# Altium project ArduinoUno_project.PrjPcb
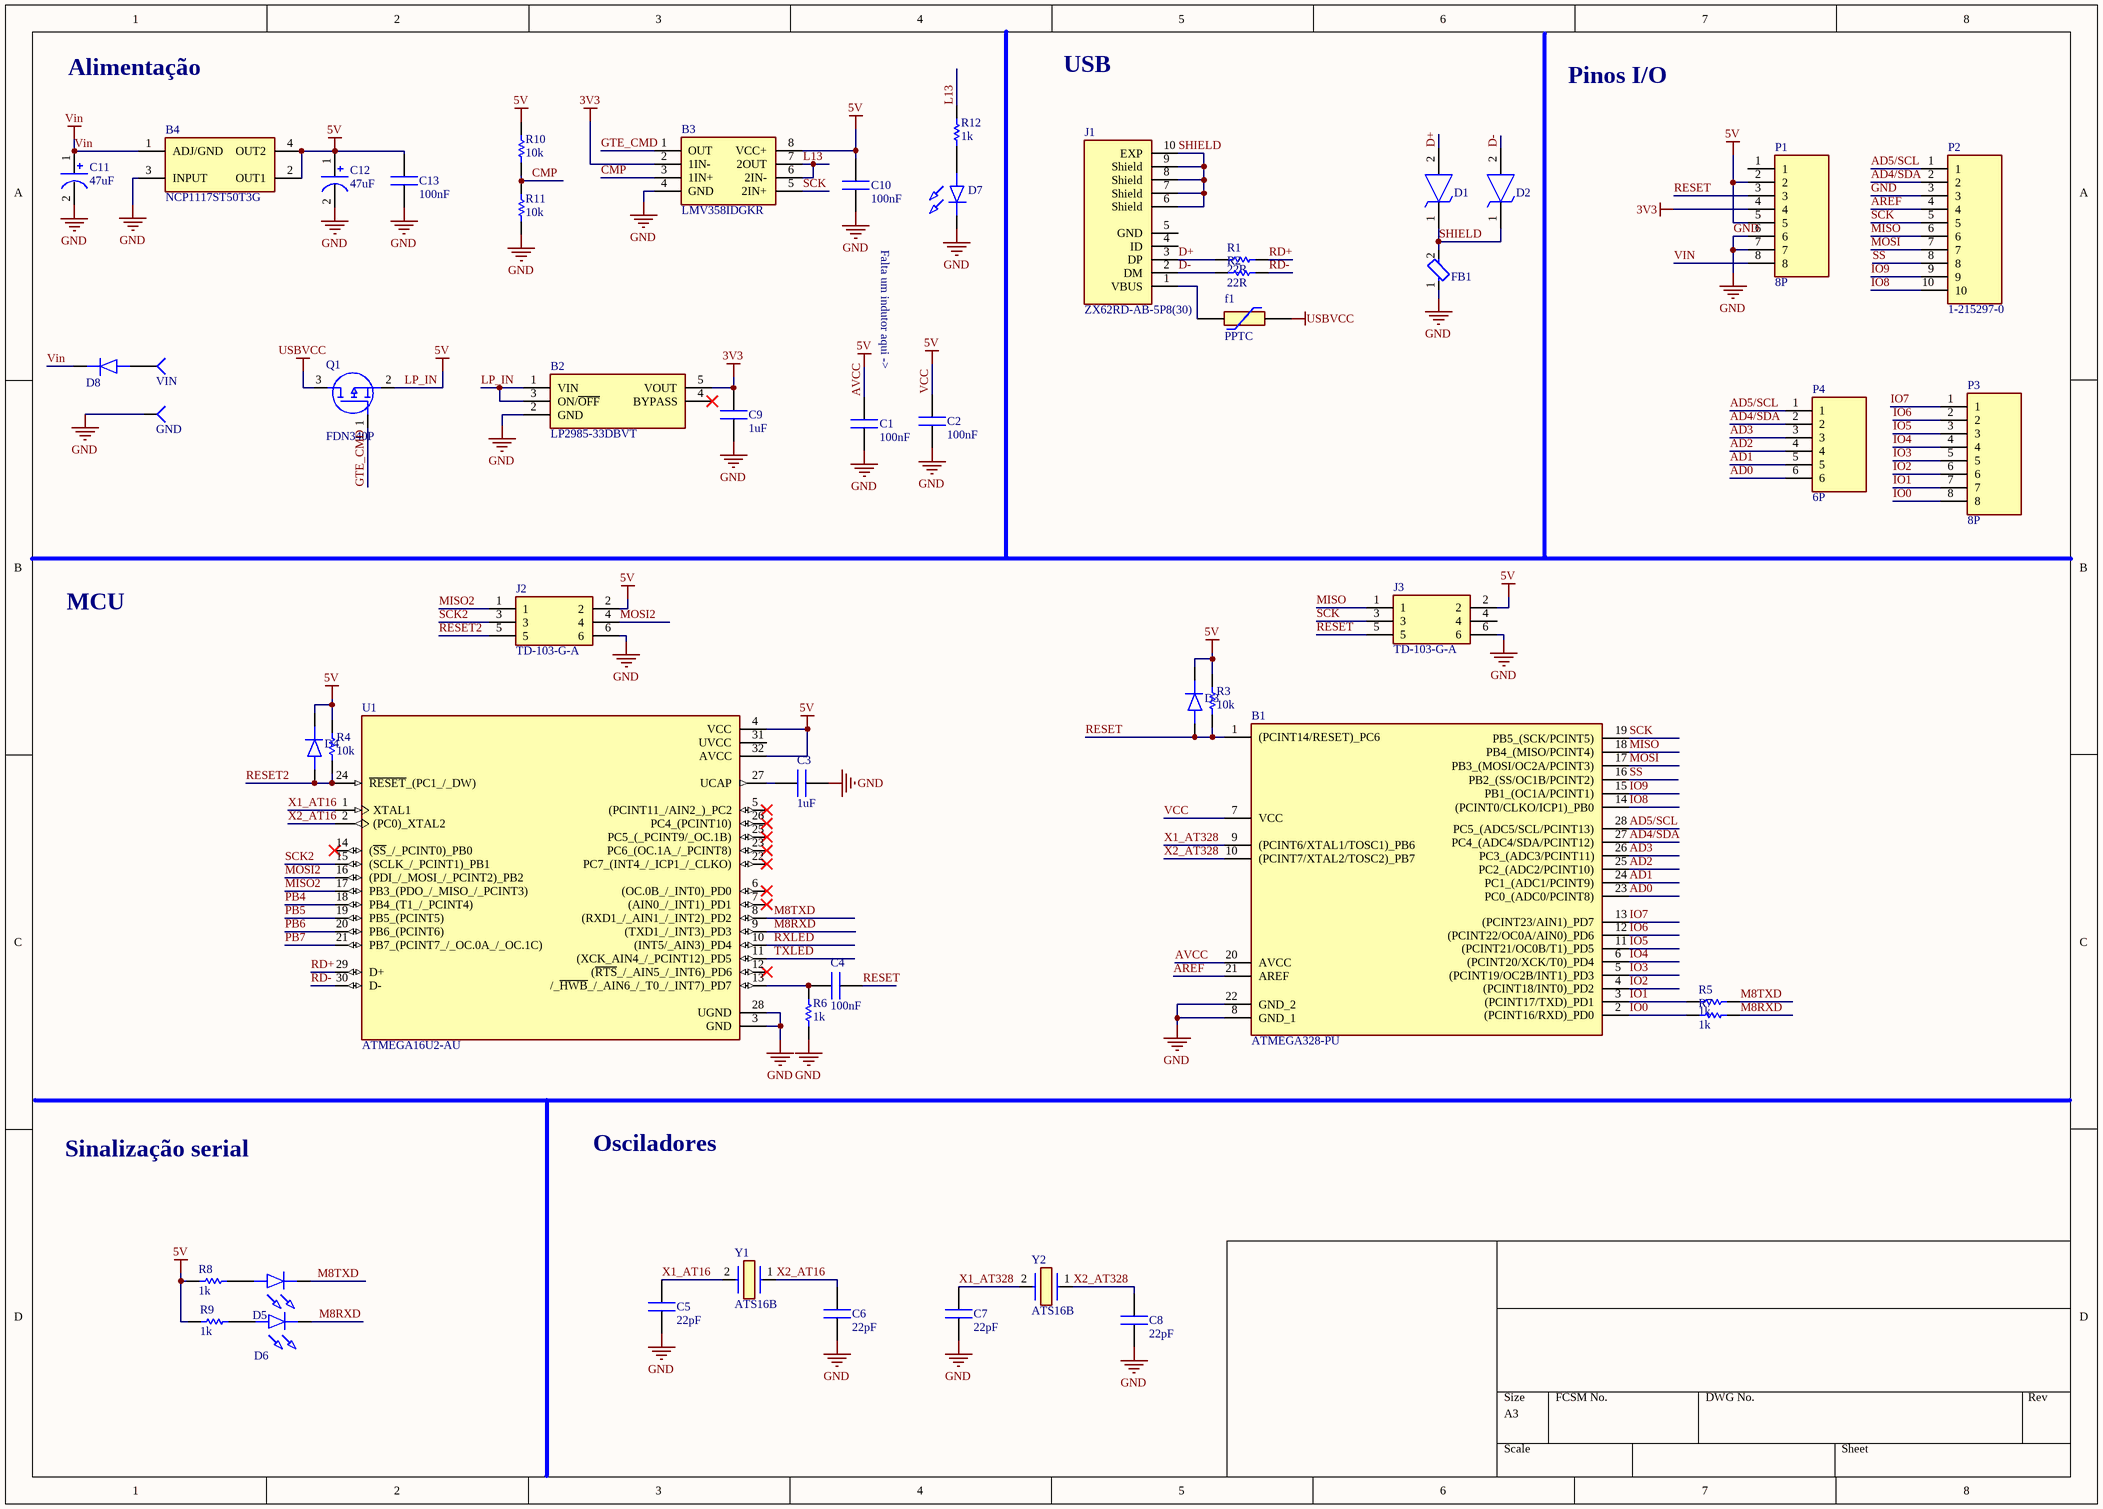
[diagram p0: ArduinoUno_project.SchDoc]
1 sheet, 52 parts. Net scope: global (net labels, ports and power ports of the same name join across sheets).
Board file: ArduinoUno_project.PcbDoc

## Sheet ArduinoUno_project.SchDoc
size A3; SheetNumber: 1; SheetTotal: 1

### Parts
B1  ATMEGA328-PU  [DIP1016W53P254L3468H457Q28N]
B2  LP2985-33DBVT  [SOT95P280X145-5N]
B3  LMV358IDGKR  [SOP65P490X110-8N]
B4  NCP1117ST50T3G  [SOT230P700X180-4N]
C1  100nF  [C0805]
C2  100nF  [C0805]
C3  1uF  [C0805]
C4  100nF  [C0805]
C5  22pF  [C0402]
C6  22pF  [C0402]
C7  22pF  [C0402]
C8  22pF  [C0402]
C9  1uF  [C0805]
C10  100nF  [C0805]
C11  47uF  [CAPAE660X565N]
C12  47uF  [CAPAE660X565N]
C13  100nF  [C0805]
D1  CDSOD323-T05S  [SOD2513X114N]  (value not drawn)
D2  CDSOD323-T05S  [SOD2513X114N]  (value not drawn)
D3  1N914  [DIOAD1068W53L380D172]  (value not drawn)
D4  1N914  [DIOAD1068W53L380D172]  (value not drawn)
D5  TLHG5420-ASZ  [TLHG5420ASZ]  (value not drawn)
D6  TLHG5420-ASZ  [TLHG5420ASZ]  (value not drawn)
D7  TLHG5420-ASZ  [TLHG5420ASZ]  (value not drawn)
D8  1N914  [DIOAD1068W53L380D172]  (value not drawn)
f1  PPTC  [MFRHS10000]
FB1  1 kOhms @ 100MHz  [BLM21]  (value not drawn)
GND  Function  [Pin - 1]  (value not drawn)  (no BOM)
J1  ZX62RD-AB-5P8(30)  [FP-ZX62RD-AB-5P8_30-MFG]
J2  TD-103-G-A  [SAMTEC_TD-103-G-A]
J3  TD-103-G-A  [SAMTEC_TD-103-G-A]
P1  8P  [RHDR8W76P0X254_1X8_2032X356X673P]
P2  1-215297-0  [TE_1-215297-0]
P3  8P  [RHDR8W76P0X254_1X8_2032X356X673P]
P4  6P  [TE_215299-6]
Q1  FDN340P  [SOT95P237X112-3N]
R1  22R  [R0805]
R2  22R  [R0805]
R3  10k  [RESAD1075W45L335D185]
R4  10k  [RESAD1075W45L335D185]
R5  1k  [RESAD1075W45L335D185]
R6  1k  [RESAD1075W45L335D185]
R7  1k  [RESAD1075W45L335D185]
R8  1k  [RESAD1075W45L335D185]
R9  1k  [RESAD1075W45L335D185]
R10  10k  [RC0603]
R11  10k  [RC0603]
R12  1k  [RESAD1075W45L335D185]
U1  ATMEGA16U2-AU  [QFP80P900X900X120-32N]
VIN  Function  [Pin - 1]  (value not drawn)  (no BOM)
Y1  ATS16B  [ATS16B]
Y2  ATS16B  [ATS16B]

### Nets
3V3: B2.5(VOUT) B3.2(1IN-) C9.2 P1.4
AVCC: B1.7(VCC) B1.20(AVCC) B2.1(VIN) B2.3(ON/~{OFF}) B3.8(VCC+) B4.2(OUT1) B4.4(OUT2) C1.2 C2.2 C10.2 C12.1 C13.1 D3.1(K) D4.1(K) J2.2 J3.2 P1.2 P1.5 Q1.2(S) R3.2 R4.2 R8.2 R9.2 R10.2 U1.4(VCC) U1.32(AVCC)  [also labelled 5V, LP_IN, VCC]
GND: B1.8(GND_1) B1.22(GND_2) B2.2(GND) B3.4(GND) B4.3(INPUT) C1.1 C2.1 C3.2 C5.1 C6.2 C7.1 C8.2 C9.1 C10.1 C11.2 C12.2 C13.2 D7.1(K) FB1.1 GND.1 J2.6 J3.6 P1.6 P1.7 P2.3 R6.1 R11.1 U1.3(GND) U1.28(UGND)
USBVCC: f1.2 Q1.3(D)
VIN: B4.1(ADJ/GND) C11.1 D8.1(K) P1.8
AD0: B1.23(PC0_(ADC0/PCINT8)) P4.6
AD1: B1.24(PC1_(ADC1/PCINT9)) P4.5
AD2: B1.25(PC2_(ADC2/PCINT10)) P4.4
AD3: B1.26(PC3_(ADC3/PCINT11)) P4.3
AD4/SDA: B1.27(PC4_(ADC4/SDA/PCINT12)) P2.2 P4.2
AD5/SCL: B1.28(PC5_(ADC5/SCL/PCINT13)) P2.1 P4.1
AREF: B1.21(AREF) P2.4
CMP: B3.3(1IN+) R10.1 R11.2
D+: D1.2(A) J1.3(DP) R1.1
D-: D2.2(A) J1.2(DM) R2.1
GTE_CMD: B3.1(OUT) Q1.1(G)
IO0: B1.2((PCINT16/RXD)_PD0) P3.8 R7.2
IO1: B1.3((PCINT17/TXD)_PD1) P3.7 R5.2
IO2: B1.4((PCINT18/INT0)_PD2) P3.6
IO3: B1.5((PCINT19/OC2B/INT1)_PD3) P3.5
IO4: B1.6((PCINT20/XCK/T0)_PD4) P3.4
IO5: B1.11((PCINT21/OC0B/T1)_PD5) P3.3
IO6: B1.12((PCINT22/OC0A/AIN0)_PD6) P3.2
IO7: B1.13((PCINT23/AIN1)_PD7) P3.1
IO8: B1.14((PCINT0/CLKO/ICP1)_PB0) P2.10
IO9: B1.15(PB1_(OC1A/PCINT1)) P2.9
L13: B3.6(2IN-) B3.7(2OUT) R12.2
M8RXD: D6.1(K) R7.1 U1.9((TXD1_/_INT3)_PD3)
M8TXD: D5.1(K) R5.1 U1.8((RXD1_/_AIN1_/_INT2)_PD2)
MISO: B1.18(PB4_(MISO/PCINT4)) J3.1 P2.6
MISO2: J2.1 U1.17(PB3_(PDO_/_MISO_/_PCINT3))
MOSI: B1.17(PB3_(MOSI/OC2A/PCINT3)) P2.7
MOSI2: J2.4 U1.16((PDI_/_MOSI_/_PCINT2)_PB2)
PB4: U1.18(PB4_(T1_/_PCINT4))
PB5: U1.19(PB5_(PCINT5))
PB6: U1.20(PB6_(PCINT6))
PB7: U1.21(PB7_(PCINT7_/_OC.0A_/_OC.1C))
RD+: R1.2 U1.29(D+)
RD-: R2.2 U1.30(D-)
RESET: B1.1((PCINT14/RESET)_PC6) C4.2 D3.2(A) J3.5 P1.3 R3.1
RESET2: D4.2(A) J2.5 R4.1 U1.24(~{RESET}_(PC1_/_DW))
RXLED: U1.10((INT5/_AIN3)_PD4)
SCK: B1.19(PB5_(SCK/PCINT5)) B3.5(2IN+) J3.3 P2.5
SCK2: J2.3 U1.15((SCLK_/_PCINT1)_PB1)
SHIELD: D1.1(K) D2.1(K) FB1.2 J1.6(Shield) J1.7(Shield) J1.8(Shield) J1.9(Shield) J1.10(EXP)
SS: B1.16(PB2_(SS/OC1B/PCINT2)) P2.8
TXLED: U1.11((XCK_AIN4_/_PCINT12)_PD5)
X1_AT16: C5.2 U1.1(XTAL1) Y1.2(CRYSTAL_2)
X1_AT328: B1.9((PCINT6/XTAL1/TOSC1)_PB6) C7.2 Y2.2(CRYSTAL_2)
X2_AT16: C6.1 U1.2((PC0)_XTAL2) Y1.1
X2_AT328: B1.10((PCINT7/XTAL2/TOSC2)_PB7) C8.1 Y2.1
NetC3_1: C3.1 U1.27(UCAP)
NetC4_1: C4.1 R6.2 U1.13(/_~{HWB}_/_AIN6_/_T0_/_INT7)_PD7)
NetD5_2: D5.2(A) R8.1
NetD6_2: D6.2(A) R9.1
NetD7_2: D7.2(A) R12.1
NetD8_2: D8.2(A) VIN.1
Netf1_1: f1.1 J1.1(VBUS)

Not connected (* = marked no-connect by the designer): B2 4(BYPASS)*; J1 4(ID) 5(GND); J3 4; P1 1; U1 5((PCINT11_/AIN2_)_PC2)* 6((OC.0B_/_INT0)_PD0)* 7((AIN0_/_INT1)_PD1)* 12((~{RTS}_/_AIN5_/_INT6)_PD6)* 14((~{SS}_/_PCINT0)_PB0)* 22(PC7_(INT4_/_ICP1_/_CLKO))* 23(PC6_(OC.1A_/_PCINT8))* 25(PC5_(_PCINT9/_OC.1B))* 26(PC4_(PCINT10))* 31(UVCC)

### Notes on the sheet
- Alimentação
- USB
- Pinos I/O
- (near C1) Falta um indutor aqui ->
- MCU
- Sinalização serial
- Osciladores
- Title
- Size:
- Date:
- A3
- Number:
- Time:
- Revision:
- Sheet
- of
- File:

### Library data of the parts
B1 = ATMEGA328-PU: 8-bit Microcontrollers - MCU AVR 32K FLSH 1K EE2K SRAM-20MHz IND; Manufacturer: Microchip; Geometry.Height: 4.572mm; Mouser Part Number: 556-ATMEGA328-PU; Mouser Price/Stock: https://www.mouser.co.uk/ProductDetail/Microchip-Technology/ATMEGA328-PU?qs=lwdSMh1%2FoYJT8tfItQpQtA%3D%3D; Datasheet Link: https://componentsearchengine.com/Datasheets/1/ATMEGA328-PU.pdf; Manufacturer Part Number: ATMEGA328-PU
B2 = LP2985-33DBVT: 150-mA LOW-NOISE LOW-DROPOUT REGULATOR WITH SHUTDOWN; Manufacturer: Texas Instruments; Geometry.Height: 1.45mm; Mouser Part Number: 595-LP2985-33DBVT; Mouser Price/Stock: https://www.mouser.co.uk/ProductDetail/Texas-Instruments/LP2985-33DBVT?qs=paYhMW8qfivCywxvLCGbYQ%3D%3D; Datasheet Link: http://www.ti.com/lit/gpn/lp2985; Manufacturer Part Number: LP2985-33DBVT
B3 = LMV358IDGKR: OP Amp Dual GP R-R O/P 5.5V 8-Pin MSOP Texas Instruments LMV358IDGKR, Dual Op Amp, 1MHz CMOS, Rail to Rail, 3 V, 5 V, 8-Pin MSOP; Geometry.Height: 1.1mm; Mouser Part Number: 595-LMV358IDGKR; Mouser Price/Stock: https://www.mouser.co.uk/ProductDetail/Texas-Instruments/LMV358IDGKR?qs=rgxfVHSNRPXxzk3brtXqQw%3D%3D; Datasheet Link: http://www.ti.com/lit/ds/symlink/lmv358.pdf; Manufacturer: Texas Instruments; Manufacturer Part Number: LMV358IDGKR
B4 = NCP1117ST50T3G: ON SEMICONDUCTOR - NCP1117ST50T3G - LDO, REG, 20VIN, 1A, 5V, 1%, SOT223-3; Manufacturer: onsemi; Geometry.Height: 1.8mm; Mouser Part Number: 863-NCP1117ST50T3G; Mouser Price/Stock: https://www.mouser.co.uk/ProductDetail/onsemi/NCP1117ST50T3G?qs=Gev%252BmEvV0ib6dijy6U0dhQ%3D%3D; Datasheet Link: http://www.onsemi.com/pub/Collateral/NCP1117-D.PDF; Manufacturer Part Number: NCP1117ST50T3G
C1 C2 C4 C10 C13 = C0805C104M3RACTU: Cap Ceramic 0.1uF 25V X7R 20% SMD 0805 125°C Paper T/R; Manufacturer: KEMET; Dissipation Factor: 5%; Supplier 1: Digi-Key; Manufacturer Part Number: C0805C104M3RACTU; RoHS: Yes; Stock 1: 190801; Pricing 1: 1 = 0,10000, 10 = 0,06200, 50 = 0,03360, 100 = 0,02750, 500 = 0,01964, 1000 = 0,01543 (USD); Mount: Surface Mount; Case/Package: 0805; Case Code (Metric): 2012; Case Code (Imperial): 0805; Dielectric Material: Ceramic; Min Operating Temperature: -55°C; Max Operating Temperature: 125°C; Package Quantity: 1; Capacitance: 100nF; Voltage Rating: 25V; Tolerance: 20%; Packaging: Tape and Reel; Voltage Rating (DC): 25V; Dielectric: X7R; Termination: SMD/SMT; Voltage: 25V; Series: C0805C; Construction: Flat; Length: 2mm; Width: 0.049inch; Height: 0.9mm; Thickness: 0.035inch; Lead Pitch: 0.75mm; Depth: 1.25mm; Radiation Hardening: No; REACH SVHC: No SVHC; ComponentLink1URL: http://www.farnell.com/datasheets/2746330.pdf?src-supplier=Farnell; ComponentLink1Description: http://www.farnell.com/datasheets/2746330.pdf?src-supplier=Farnell; ComponentLink2URL: https://www.alliedelec.com/m/d/6f3b5eb83d09db50ed28bdc730567b33.pdf?src-supplier=Allied+Electronics; ComponentLink2Description: https://www.alliedelec.com/m/d/6f3b5eb83d09db50ed28bdc730567b33.pdf?src-supplier=Allied+Electronics; ComponentLink3URL: http://uk.rs-online.com/webdocs/13da/0900766b813daa05.pdf?src-supplier=RSComponents; ComponentLink3Description: http://uk.rs-online.com/webdocs/13da/0900766b813daa05.pdf?src-supplier=RSComponents; ComponentLink4URL: http://uk.rs-online.com/webdocs/13da/0900766b813da9ff.pdf?src-supplier=RSComponents; ComponentLink4Description: http://uk.rs-online.com/webdocs/13da/0900766b813da9ff.pdf?src-supplier=RSComponents; ComponentLink5URL: https://www.alliedelec.com/m/d/e7aa2b5497e2375e4ffc0e8be19e16e2.pdf?src-supplier=Allied+Electronics; ComponentLink5Description: https://www.alliedelec.com/m/d/e7aa2b5497e2375e4ffc0e8be19e16e2.pdf?src-supplier=Allied+Electronics; ComponentLink6URL: http://www.jameco.com/Jameco/Products/ProdDS/1566487.pdf?src-supplier=Jameco; ComponentLink6Description: http://www.jameco.com/Jameco/Products/ProdDS/1566487.pdf?src-supplier=Jameco; ComponentLink7URL: http://www.mouser.com/ds/2/212/KEM_C1002_X7R_SMD-1102033.pdf?src-supplier=Mouser; ComponentLink7Description: http://www.mouser.com/ds/2/212/KEM_C1002_X7R_SMD-1102033.pdf?src-supplier=Mouser; ComponentLink8URL: http://components.arrow.com/part/dataview/2091097S3491315N7429?src-supplier=Arrow+Electronics; ComponentLink8Description: http://components.arrow.com/part/dataview/2091097S3491315N7429?src-supplier=Arrow+Electronics; ComponentLink9URL: http://components.arrow.com/part/dataview/0323_00178100?src-supplier=Arrow+Europe; ComponentLink9Description: http://components.arrow.com/part/dataview/0323_00178100?src-supplier=Arrow+Europe; ComponentLink10URL: https://api.kemet.com/component-edge/download/datasheet/C0805C104M3RACTU.pdf?src-supplier=Digi-Key; ComponentLink10Description: https://api.kemet.com/component-edge/download/datasheet/C0805C104M3RACTU.pdf?src-supplier=Digi-Key; ComponentLink11URL: http://www.farnell.com/datasheets/2746330.pdf?src-supplier=Newark; ComponentLink11Description: http://www.farnell.com/datasheets/2746330.pdf?src-supplier=Newark; ComponentLink12URL: http://www.farnell.com/datasheets/1828800.pdf?src-supplier=Newark; ComponentLink12Description: http://www.farnell.com/datasheets/1828800.pdf?src-supplier=Newark; ComponentLink13URL: http://capacitoredge.kemet.com/capedge2/DataSheet?pn=C0805C104M3RACTU&src-supplier=Avnet; ComponentLink13Description: http://capacitoredge.kemet.com/capedge2/DataSheet?pn=C0805C104M3RACTU&src-supplier=Avnet; ComponentLink14URL: http://www.farnell.com/datasheets/2746330.pdf?src-supplier=Element14; ComponentLink14Description: http://www.farnell.com/datasheets/2746330.pdf?src-supplier=Element14; Supplier Part Number 1: 399-C0805C104M3RAC7800CT-ND
C3 C9 = C0805C105M3RACTU: Multilayer Ceramic Capacitors MLCC - SMD/SMT 25V 1uF X7R 0805 20%; Manufacturer: KEMET; Manufacturer Part Number: C0805C104M3RACTU; Dissipation Factor: 5%; Supplier 1: Digi-Key; RoHS: Yes; Stock 1: 190801; Pricing 1: 1 = 0,10000, 10 = 0,06200, 50 = 0,03360, 100 = 0,02750, 500 = 0,01964, 1000 = 0,01543 (USD); Mount: Surface Mount; Case/Package: 0805; Case Code (Metric): 2012; Case Code (Imperial): 0805; Dielectric Material: Ceramic; Min Operating Temperature: -55°C; Max Operating Temperature: 125°C; Package Quantity: 1; Capacitance: 1uF; Voltage Rating: 25V; Tolerance: 20%; Packaging: Tape and Reel; Voltage Rating (DC): 25V; Dielectric: X7R; Termination: SMD/SMT; Voltage: 25V; Series: C0805C; Construction: Flat; Length: 2mm; Width: 0.049inch; Height: 0.9mm; Thickness: 0.035inch; Lead Pitch: 0.75mm; Depth: 1.25mm; Radiation Hardening: No; REACH SVHC: No SVHC; ComponentLink1URL: http://www.farnell.com/datasheets/2746330.pdf?src-supplier=Farnell; ComponentLink1Description: http://www.farnell.com/datasheets/2746330.pdf?src-supplier=Farnell; ComponentLink2URL: https://www.alliedelec.com/m/d/6f3b5eb83d09db50ed28bdc730567b33.pdf?src-supplier=Allied+Electronics; ComponentLink2Description: https://www.alliedelec.com/m/d/6f3b5eb83d09db50ed28bdc730567b33.pdf?src-supplier=Allied+Electronics; ComponentLink3URL: http://uk.rs-online.com/webdocs/13da/0900766b813daa05.pdf?src-supplier=RSComponents; ComponentLink3Description: http://uk.rs-online.com/webdocs/13da/0900766b813daa05.pdf?src-supplier=RSComponents; ComponentLink4URL: http://uk.rs-online.com/webdocs/13da/0900766b813da9ff.pdf?src-supplier=RSComponents; ComponentLink4Description: http://uk.rs-online.com/webdocs/13da/0900766b813da9ff.pdf?src-supplier=RSComponents; ComponentLink5URL: https://www.alliedelec.com/m/d/e7aa2b5497e2375e4ffc0e8be19e16e2.pdf?src-supplier=Allied+Electronics; ComponentLink5Description: https://www.alliedelec.com/m/d/e7aa2b5497e2375e4ffc0e8be19e16e2.pdf?src-supplier=Allied+Electronics; ComponentLink6URL: http://www.jameco.com/Jameco/Products/ProdDS/1566487.pdf?src-supplier=Jameco; ComponentLink6Description: http://www.jameco.com/Jameco/Products/ProdDS/1566487.pdf?src-supplier=Jameco; ComponentLink7URL: http://www.mouser.com/ds/2/212/KEM_C1002_X7R_SMD-1102033.pdf?src-supplier=Mouser; ComponentLink7Description: http://www.mouser.com/ds/2/212/KEM_C1002_X7R_SMD-1102033.pdf?src-supplier=Mouser; ComponentLink8URL: http://components.arrow.com/part/dataview/2091097S3491315N7429?src-supplier=Arrow+Electronics; ComponentLink8Description: http://components.arrow.com/part/dataview/2091097S3491315N7429?src-supplier=Arrow+Electronics; ComponentLink9URL: http://components.arrow.com/part/dataview/0323_00178100?src-supplier=Arrow+Europe; ComponentLink9Description: http://components.arrow.com/part/dataview/0323_00178100?src-supplier=Arrow+Europe; ComponentLink10URL: https://api.kemet.com/component-edge/download/datasheet/C0805C104M3RACTU.pdf?src-supplier=Digi-Key; ComponentLink10Description: https://api.kemet.com/component-edge/download/datasheet/C0805C104M3RACTU.pdf?src-supplier=Digi-Key; ComponentLink11URL: http://www.farnell.com/datasheets/2746330.pdf?src-supplier=Newark; ComponentLink11Description: http://www.farnell.com/datasheets/2746330.pdf?src-supplier=Newark; ComponentLink12URL: http://www.farnell.com/datasheets/1828800.pdf?src-supplier=Newark; ComponentLink12Description: http://www.farnell.com/datasheets/1828800.pdf?src-supplier=Newark; ComponentLink13URL: http://capacitoredge.kemet.com/capedge2/DataSheet?pn=C0805C104M3RACTU&src-supplier=Avnet; ComponentLink13Description: http://capacitoredge.kemet.com/capedge2/DataSheet?pn=C0805C104M3RACTU&src-supplier=Avnet; ComponentLink14URL: http://www.farnell.com/datasheets/2746330.pdf?src-supplier=Element14; ComponentLink14Description: http://www.farnell.com/datasheets/2746330.pdf?src-supplier=Element14; Supplier Part Number 1: 399-C0805C104M3RAC7800CT-ND
C5-C8 = C0402C220K5GACTU: CAP CER 22PF 50V C0G/NP0 0402; Manufacturer: KEMET; Dielectric Material: Ceramic; Tolerance: 10%; Dielectric: C0G; Dissipation Factor: 0.1%; Supplier 1: Digi-Key; Supplier Part Number 1: 399-7775-1-ND; Manufacturer Part Number: C0402C220K5GACTU; RoHS: Yes; Category: Ceramic Capacitors; Stock 1: 2121934; Pricing 1: 1=0,10000, 10=0,02100, 50=0,01160, 100=0,00950, 500=0,00678, 1000=0,00532, 2500=0,00484, 5000=0,00445 (USD); Mount: Surface Mount; Case/Package: 0402; Case Code (Metric): 1005; Case Code (Imperial): 0402; Min Operating Temperature: -55°C; Max Operating Temperature: 125°C; Package Quantity: 1; Capacitance: 22pF; Voltage Rating: 50V; Packaging: Tape and Reel; Voltage Rating (DC): 50V; Termination: SMD/SMT; Length: 1mm; Height: 0.5mm; Width: 0.02inch; Thickness: 0.022inch; Lead Pitch: 0.3mm; Depth: 0.5mm; Radiation Hardening: No; REACH SVHC: No SVHC; Lead Free: Lead Free; ComponentLink1URL: https://datasheet.ciiva.com/18192/getdatasheetpartid-362104-18192458.pdf?src-supplier=Verical; ComponentLink1Description: https://datasheet.ciiva.com/18192/getdatasheetpartid-362104-18192458.pdf?src-supplier=Verical; ComponentLink2URL: https://datasheet.ciiva.com/6874/1828801-6874332.pdf?src-supplier=Newark; ComponentLink2Description: https://datasheet.ciiva.com/6874/1828801-6874332.pdf?src-supplier=Newark; ComponentLink3URL: https://datasheet.ciiva.com/5423/kem-c1003-c0g-smd-356956-5423869.pdf?src-supplier=Mouser; ComponentLink3Description: https://datasheet.ciiva.com/5423/kem-c1003-c0g-smd-356956-5423869.pdf?src-supplier=Mouser
C11 C12 = EDK476M025A9GAA: Cap Aluminum 47uF 25V 20% (6.3 X 5.4mm) SMD 70mA 2000 hr 85°C T/R -    PN Alternativo : EDK476M025A9GAA; Manufacturer: KEMET; Life (Hours): 2000Hour; Supplier 1: Mouser; Manufacturer Part Number: EDK476M025A9GAA; RoHS: Yes; Stock 1: 8213; Pricing 1: 1 = 0,39000, 10 = 0,19000, 50 = 0,19000, 100 = 0,16300, 1000 = 0,10200, 10000 = 0,08100 (USD); Mount: Surface Mount,PCB; Case/Package: Radial; Min Operating Temperature: -40°C; Max Operating Temperature: 85°C; Capacitance: 47uF; Tolerance: 20%; Ripple Current: 70mA; Voltage Rating: 25V; Packaging: Tape and Reel; Package Quantity: 1; Voltage Rating (DC): 25V; Termination: SMD/SMT; Series: EDK; Construction: Cylindrical; Ripple Current (AC): 70mA; Diameter: 6.3mm; Length: 5.5mm; Height: 5.4mm; Height - Seated (Max): 0.217inch; Radiation Hardening: No; RoHS Compliant: Yes; REACH SVHC: No SVHC; ComponentLink1URL: https://datasheet.ciiva.com/5365/kem-a4001-edk-535350-5365071.pdf?src-supplier=Mouser; ComponentLink1Description: https://datasheet.ciiva.com/5365/kem-a4001-edk-535350-5365071.pdf?src-supplier=Mouser; Supplier Part Number 1: 80-EDK476M025A9GAA
D1 D2 = CDSOD323-T05S: TVS Diode (Uni-directional); Manufacturer: Bourns; Datasheet Link: http://www.bourns.com/docs/Product-Datasheets/CDSOD323-TxxSC.pdf; Height: 1.14mm; Mouser Part Number: 652-CDSOD323-T05S; Mouser Price/Stock: https://www.mouser.co.uk/ProductDetail/Bourns/CDSOD323-T05S?qs=6S5Watp5UnKwEEYVMBfMmA%3D%3D; Arrow Part Number: CDSOD323-T05S; Arrow Price/Stock: https://www.arrow.com/en/products/cdsod323-t05s/bourns?region=nac; Manufacturer Part Number: CDSOD323-T05S
D3 D4 D8 = 1N914: Small Signal Diode; Manufacturer: onsemi; Mouser Part Number: 512-1N914; Mouser Price/Stock: https://www.mouser.co.uk/ProductDetail/onsemi-Fairchild/1N914?qs=NSEUUqpg2uCfNuQFcxVZsA%3D%3D; Datasheet Link: https://www.onsemi.com/pub/Collateral/1N914-D.PDF; Manufacturer Part Number: 1N914
D5-D7 = TLHG5420-ASZ: Standard LEDs - Through Hole 5MM LED GREEN TINT. DIFFused with Standoff; Manufacturer: Vishay; Geometry.Height: 12.8mm; Mouser Part Number: 78-TLHG5420-ASZ; Mouser Price/Stock: https://www.mouser.co.uk/ProductDetail/Vishay-Siliconix/TLHG5420-ASZ?qs=M%2FWrVUahkW9Iv5EBNpgqMA%3D%3D; Datasheet Link: https://www.vishay.com/docs/86335/tlhg542_tlhg642.pdf; Manufacturer Part Number: TLHG5420-ASZ
f1 = MF-RHS1000-0: PTC 10.0A 16V RADIAL LEADED HI-TEMP; Manufacturer: Bourns; Geometry.Height: 27.9mm; Mouser Part Number: 652-MF-RHS1000-0; Mouser Price/Stock: https://www.mouser.co.uk/ProductDetail/Bourns/MF-RHS1000-0?qs=mELouGlnn3f3cOBjSincOA%3D%3D; Datasheet Link: *; Manufacturer Part Number: MF-RHS1000-0
FB1 = BLM21AG102SN1D: MURATA - BLM21AG102SN1D - Ferritperle, 0805 [Metrisch 2012], 1 kohm, 500 mA, Baureihe BLM21A, 0.28 ohm, ± 25% / PN Alternativo: BLM21BD102SN1D; Core Material: Ferrite; Material: Steel,Ferrite; Impedance: 1kR; Max Current Rating: 600mA; Current Rating: 500mA; Max DC Current: 200mA; DC Resistance (DCR): 280mR; Number of Lines: 1; Shielding: Unshielded; Input Capacitance: 850pF; Max Power Dissipation: 3.1W; Rds On Max: 24mR; Drain to Source Voltage (Vdss): 60V; Continuous Drain Current (ID): 20A; Power Dissipation: 19W; Turn-Off Delay Time: 17ns; Turn-On Delay Time: 9ns; Threshold Voltage: 3V; Element Configuration: Single; Gate to Source Voltage (Vgs): 20V; Polarity: N-CHANNEL; Supplier 1: Digi-Key; Supplier Part Number 1: 490-1041-1-ND; Manufacturer: Murata; Manufacturer Part Number: BLM21AG102SN1D; RoHS: Yes; Category: Inductors; Stock 1: 93441; Pricing 1: 1=0,17000, 10=0,14100, 25=0,10960, 50=0,09100, 100=0,07840, 250=0,06272, 500=0,05644, 1000=0,04703 (USD); Case/Package: 0805; Number of Pins: 2; Weight: 0.000194oz; Case Code (Metric): 2012; Case Code (Imperial): 0805; Min Operating Temperature: -55°C; Max Operating Temperature: 125°C; Packaging: Tape and Reel; Frequency: 100MHz; Tolerance: 25%; Package Quantity: 1; Termination: SMD/SMT; Test Frequency: 100MHz; DC Current: 200mA; Military Standard: Not; Number of Circuits: 1; Length: 2mm; Height: 0.85mm; Width: 1.25mm; Depth: 1.25mm; Radiation Hardening: No; REACH SVHC: No SVHC; Lead Free: Lead Free; ComponentLink1URL: https://datasheet.ciiva.com/19454/1845136-19454717.pdf?src-supplier=Jameco; ComponentLink1Description: https://datasheet.ciiva.com/19454/1845136-19454717.pdf?src-supplier=Jameco; ComponentLink2URL: https://datasheet.ciiva.com/18093/getdatasheetpartid-139643-18093010.pdf?src-supplier=Verical; ComponentLink2Description: https://datasheet.ciiva.com/18093/getdatasheetpartid-139643-18093010.pdf?src-supplier=Verical; ComponentLink3URL: https://datasheet.ciiva.com/41449/001172322-da-01-en-drossel-0805-1000r-2-0x1-25mm-4000st-41449636.pdf?src-supplier=Conrad; ComponentLink3Description: https://datasheet.ciiva.com/41449/001172322-da-01-en-drossel-0805-1000r-2-0x1-25mm-4000st-41449636.pdf?src-supplier=Conrad; ComponentLink4URL: https://datasheet.ciiva.com/29347/442432-da-01-en-chip-drossel-0805-1000r-200ma-2-0x1-25mm-29347996.pdf?src-supplier=Conrad; ComponentLink4Description: https://datasheet.ciiva.com/29347/442432-da-01-en-chip-drossel-0805-1000r-200ma-2-0x1-25mm-29347996.pdf?src-supplier=Conrad; ComponentLink5URL: https://datasheet.ciiva.com/25903/l0110s0100blm21a-25903493.pdf?src-supplier=Avnet+Europe; ComponentLink5Description: https://datasheet.ciiva.com/25903/l0110s0100blm21a-25903493.pdf?src-supplier=Avnet+Europe; ComponentLink6URL: https://datasheet.ciiva.com/3081/l0110s0100blm21a-3081640.pdf?src-supplier=Avnet; ComponentLink6Description: https://datasheet.ciiva.com/3081/l0110s0100blm21a-3081640.pdf?src-supplier=Avnet; ComponentLink7URL: https://datasheet.ciiva.com/6212/l0110s0100blm21a-6212345.pdf?src-supplier=Digi-Key; ComponentLink7Description: https://datasheet.ciiva.com/6212/l0110s0100blm21a-6212345.pdf?src-supplier=Digi-Key; ComponentLink8URL: https://datasheet.ciiva.com/6212/l0110s0100blm21a-6212347.pdf?src-supplier=Digi-Key; ComponentLink8Description: https://datasheet.ciiva.com/6212/l0110s0100blm21a-6212347.pdf?src-supplier=Digi-Key; ComponentLink9URL: https://datasheet.ciiva.com/16286/l0110s0100blm21a-16286461.pdf?src-supplier=Future+Electronics; ComponentLink9Description: https://datasheet.ciiva.com/16286/l0110s0100blm21a-16286461.pdf?src-supplier=Future+Electronics; ComponentLink10URL: https://datasheet.ciiva.com/6212/l0110s0100blm21a-6212318.pdf?src-supplier=Digi-Key; ComponentLink10Description: https://datasheet.ciiva.com/6212/l0110s0100blm21a-6212318.pdf?src-supplier=Digi-Key; ComponentLink11URL: https://datasheet.ciiva.com/3082/l0110s0100blm21a-3082728.pdf?src-supplier=Avnet; ComponentLink11Description: https://datasheet.ciiva.com/3082/l0110s0100blm21a-3082728.pdf?src-supplier=Avnet; ComponentLink12URL: https://datasheet.ciiva.com/8021/l0110s0100blm21a-8021548.pdf?src-supplier=Element14; ComponentLink12Description: https://datasheet.ciiva.com/8021/l0110s0100blm21a-8021548.pdf?src-supplier=Element14; ComponentLink13URL: https://datasheet.ciiva.com/8021/l0110s0100blm21a-8021550.pdf?src-supplier=Element14; ComponentLink13Description: https://datasheet.ciiva.com/8021/l0110s0100blm21a-8021550.pdf?src-supplier=Element14; Supplier 2: Digi-Key; Pricing 2: 1 = 0,93000, 10 = 0,82200, 100 = 0,63010, 500 = 0,49808 (USD); Series: -; Number of Elements: 1; Drain to Source Breakdown Voltage: 60V; Drain to Source Resistance: 24mR; RoHS Compliant: Yes; ComponentLink14URL: https://datasheet.ciiva.com/6380/nttfs5826nl-d-6380502.pdf?src-supplier=Digi-Key; ComponentLink14Description: https://datasheet.ciiva.com/6380/nttfs5826nl-d-6380502.pdf?src-supplier=Digi-Key; ComponentLink15URL: https://datasheet.ciiva.com/11166/nttfs5826nl-d-11166227.pdf?src-supplier=Avnet; ComponentLink15Description: https://datasheet.ciiva.com/11166/nttfs5826nl-d-11166227.pdf?src-supplier=Avnet; ComponentLink16URL: https://datasheet.ciiva.com/26145/nttfs5826nl-d-26145731.pdf?src-supplier=Avnet+Europe; ComponentLink16Description: https://datasheet.ciiva.com/26145/nttfs5826nl-d-26145731.pdf?src-supplier=Avnet+Europe; ComponentLink17URL: https://datasheet.ciiva.com/4438/nttfs5826nl-d-97426-4438348.pdf?src-supplier=Mouser; ComponentLink17Description: https://datasheet.ciiva.com/4438/nttfs5826nl-d-97426-4438348.pdf?src-supplier=Mouser; ComponentLink18URL: https://datasheet.ciiva.com/30480/0900766b8120607b-30480146.pdf?src-supplier=RSComponents; ComponentLink18Description: https://datasheet.ciiva.com/30480/0900766b8120607b-30480146.pdf?src-supplier=RSComponents; ComponentLink19URL: https://datasheet.ciiva.com/6380/nttfs5826nl-d-6380508.pdf?src-supplier=Digi-Key; ComponentLink19Description: https://datasheet.ciiva.com/6380/nttfs5826nl-d-6380508.pdf?src-supplier=Digi-Key
GND VIN = PIN
J1 = USB Connector: CONN RCPT USB2.0 MICRO AB SMD RA; Manufacturer: Hirose Connector; Number of Contacts: 5; Gender: Receptacle; Connector Type: USB; Packaging: Tape and Reel; Contact Material: Copper Alloy; Mount: Surface Mount; USB Standard: USB 2.0; RoHS Compliant: Yes; Contact Plating: Gold; Orientation: Right Angle; Lead Free: Lead Free; Manufacturer Part Number: ZX62RD-AB-5P8(30)
J2 J3 = TD-103-G-A: Connecteur Embase Trou traversant 6 positions 0,100po (2,54mm); Manufacturer: Samtec Inc.; SnapEDA_Link: https://www.snapeda.com/parts/TD-103-G-A/Samtec+Inc./view-part/?ref=snap; Package: None; Value: *; Check_prices: https://www.snapeda.com/parts/TD-103-G-A/Samtec+Inc./view-part/?ref=eda; Manufacturer Part Number: TD-103-G-A
P1 P3 = 5-535541-6: Connector Socket Strip RCP 8 POS 2.54mm Solder ST Thru-Hole Gang of Tubes; Manufacturer: TE Connectivity; SnapEDA_Link: https://www.snapeda.com/parts/5-535541-6/TE%20Connectivity%20AMP%20Connectors/view-part/497141/?ref=snap; Price: None; Availability: Unavailable; Package: None; Value: *; Manufacturer Part Number: 5-535541-6
P2 = 1-215297-0: 10P HV100 REC CON. TE, 7.0MM; Manufacturer: TE Connectivity; Price: None; EU_RoHS_Compliance: Compliant; Value: *; TE_purchase_URL: https://www.te.com/usa-en/product-1-215297-0.html?te_bu=Cor&te_type=disp&te_campaign=seda_glo_cor-seda-global-disp-prtnr-fy19-seda-model-bom-cta_sma-317_1&elqCampaignId=32493; Package: None; SnapEDA_Link: https://www.snapeda.com/parts/1-215297-0/TE%20Connectivity%20AMP%20Connectors/view-part/2366147/?ref=snap; Availability: Unavailable; Manufacturer Part Number: 1-215297-0
P4 = 215299-6: Manufacturer: {'manufacturer': 'TE Connectivity'}; Package: None; Value: *; Price: None; Availability: Unavailable; Manufacturer Part Number: 215299-6
Q1 = FDN340P: Trans MOSFET P-CH 20V 2A 3-Pin SuperSOT; Manufacturer: onsemi; Geometry.Height: 1.12mm; Mouser Part Number: 512-FDN340P; Mouser Price/Stock: https://www.mouser.co.uk/ProductDetail/onsemi-Fairchild/FDN340P?qs=AMp2PTjoga9dhzFXRaqTZw%3D%3D; Datasheet Link: https://www.onsemi.com/pub/Collateral/FDN340P-D.PDF; Manufacturer Part Number: FDN340P
R1 R2 = RCA080522R0FKEA: Thick Film Resistors - SMD 22ohms 1% 100ppm; Manufacturer: Vishay; Datasheet Link: https://www.mouser.se/datasheet/2/427/rcae3-1761931.pdf; Height: 0.5mm; Mouser Part Number: 71-RCA080522R0FKEA; Mouser Price/Stock: https://www.mouser.co.uk/ProductDetail/Vishay-Draloric/RCA080522R0FKEA?qs=AvgxZrxb8y2flqwx8oksMg%3D%3D; Manufacturer Part Number: RCA080522R0FKEA
R3 R4 = MFS1_4CC1002F: Fixed Resistor, Metal Film, 0.25W, 10000ohm, 250V, 1% +/-Tol, 50ppm/Cel, Through Hole Mount; Manufacturer: KOA Speer; Manufacturer Part Number: MFS1/4CC1001F; Mouser Part Number: 660-MFS1/4CC1001F; Mouser Price/Stock: https://www.mouser.co.uk/ProductDetail/KOA-Speer/MFS1-4CC1001F?qs=W1HJaynCbQwggh46CLL3yw%3D%3D; Datasheet Link: https://www.koaspeer.com/catimages/Products/MF-MFS-RK/MF-MFS-RK.pdf
R5-R9 R12 = MFS1_4CC1001F: KOA Axial Metal Film Resistor 1k +/-1% 0.25W +/-50ppm/C; Manufacturer: KOA Speer; Manufacturer Part Number: MFS1/4CC1001F; Mouser Part Number: 660-MFS1/4CC1001F; Mouser Price/Stock: https://www.mouser.co.uk/ProductDetail/KOA-Speer/MFS1-4CC1001F?qs=W1HJaynCbQwggh46CLL3yw%3D%3D; Datasheet Link: https://www.koaspeer.com/catimages/Products/MF-MFS-RK/MF-MFS-RK.pdf
R10 R11 = RC0603FR-0710KL: 10 kOhms ±1% 0.1W, 1/10W Chip Resistor 0603 (1608 Metric)  Thick Film; Manufacturer: Yageo; Resistance: 10kR; Temperature Coefficient: 100ppm/°C; Voltage Rating (DC): 50V; Power Rating: 100mW; Voltage Rating: 75V; Supplier 1: Digi-Key; Manufacturer Part Number: RC0603FR-0710KL; RoHS: Yes; Stock 1: 18983194; Pricing 1: 1 = 0,10000, 10 = 0,02100, 100 = 0,00850, 1000 = 0,00382, 2500 = 0,00331 (USD); Case/Package: 0603; Number of Pins: 2; Weight: 7.1E-05oz; Case Code (Imperial): 0603; Case Code (Metric): 1608; Min Operating Temperature: -55°C; Max Operating Temperature: 155°C; Packaging: Tape and Reel; Tolerance: 1%; Resistor Type: Thick Film; Termination: SMD/SMT; Length: 1.6mm; Height: 0.45mm; Width: 0.8mm; Depth: 0.8mm; Lead Pitch: 0.3mm; REACH SVHC: No SVHC; Lead Free: Lead Free; Military Standard: Not; ComponentLink1URL: https://datasheet.ciiva.com/7660/38590-7660789.pdf?src-supplier=Element14; ComponentLink1Description: https://datasheet.ciiva.com/7660/38590-7660789.pdf?src-supplier=Element14; ComponentLink2URL: https://datasheet.ciiva.com/15189/getdatasheetpartid-409289-15189591.pdf?src-supplier=Verical; ComponentLink2Description: https://datasheet.ciiva.com/15189/getdatasheetpartid-409289-15189591.pdf?src-supplier=Verical; ComponentLink3URL: https://datasheet.ciiva.com/46440/1868787-46440891.pdf?src-supplier=Element14; ComponentLink3Description: https://datasheet.ciiva.com/46440/1868787-46440891.pdf?src-supplier=Element14; ComponentLink4URL: https://datasheet.ciiva.com/7983/443971-7983596.pdf?src-supplier=Element14; ComponentLink4Description: https://datasheet.ciiva.com/7983/443971-7983596.pdf?src-supplier=Element14; ComponentLink5URL: https://datasheet.ciiva.com/7746/1738695-7746239.pdf?src-supplier=Element14; ComponentLink5Description: https://datasheet.ciiva.com/7746/1738695-7746239.pdf?src-supplier=Element14; ComponentLink6URL: https://datasheet.ciiva.com/22747/443971-22747519.pdf?src-supplier=Element14; ComponentLink6Description: https://datasheet.ciiva.com/22747/443971-22747519.pdf?src-supplier=Element14; Supplier Part Number 1: 311-10.0KHRCT-ND
U1 = ATMEGA16U2-AU: AVR AVRÂ® ATmega Microcontroller IC 8-Bit 16MHz 16KB (8K x 16) FLASH 32-TQFP (7x7); Manufacturer: Microchip; Package: TQFP-32 Microchip; Price: None; Check_prices: https://www.snapeda.com/parts/ATMEGA16U2-AU/Microchip/view-part/?ref=eda; Value: *; SnapEDA_Link: https://www.snapeda.com/parts/ATMEGA16U2-AU/Microchip/view-part/?ref=snap; Availability: In Stock; Purchase-URL: https://pricing.snapeda.com/search?q=ATMEGA16U2-AU&ref=eda; Manufacturer Part Number: ATMEGA16U2-AU
Y1 Y2 = ATS16B: Crystal or Oscillator; Manufacturer: CTS; Datasheet Link: https://componentsearchengine.com/Datasheets/1/ATS16B.pdf; Height: 4.3mm; Mouser Part Number: 774-ATS16B; Mouser Price/Stock: https://www.mouser.co.uk/ProductDetail/CTS-Electronic-Components/ATS16B?qs=tjlMjqRIEYRZOBq8cfzh0Q%3D%3D; Arrow Part Number: ATS16B; Arrow Price/Stock: https://www.arrow.com/en/products/ats16b/cts; Manufacturer Part Number: ATS16B